# Altium project NumPadAltium.PrjPcb
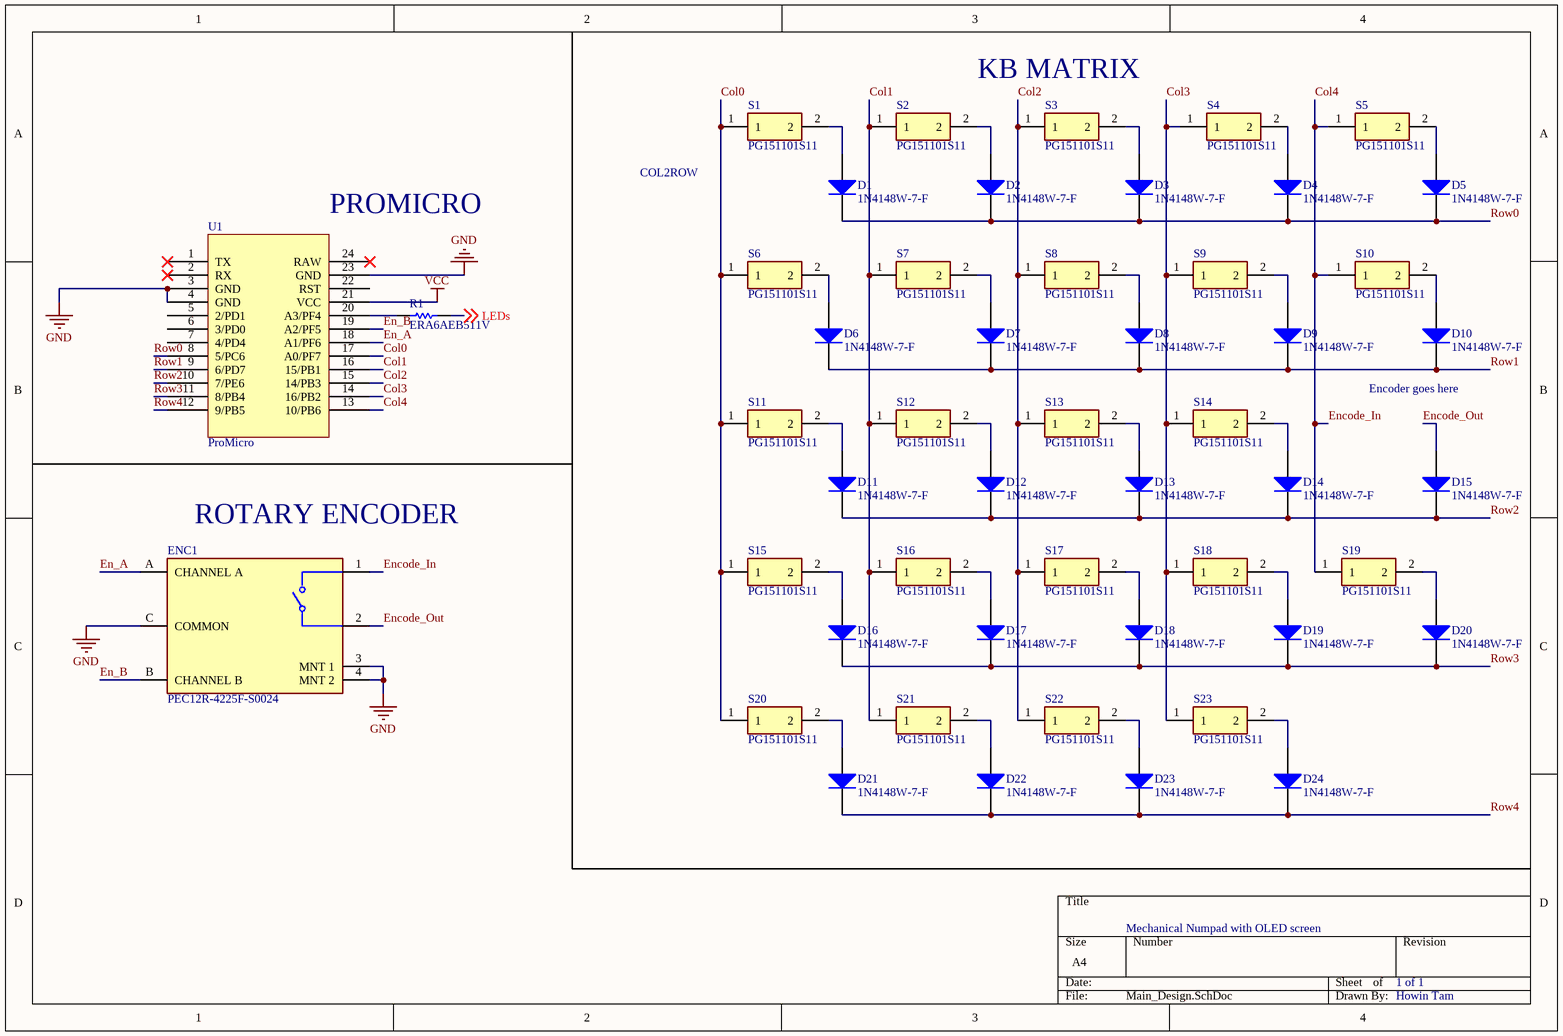
[diagram p0: Main_Design.SchDoc]
2 sheets, 96 parts. Net scope: global (net labels, ports and power ports of the same name join across sheets).
Board file: NumPadPCB.PcbDoc
Sheets:
  Main_Design.SchDoc
  InSwitchLEDs.SchDoc

## Sheet Main_Design.SchDoc
size A4; SheetNumber: 1; SheetTotal: 2

### Parts
D1  1N4148W-7-F  [DIOD-SOD123-2_V]
D2  1N4148W-7-F  [DIOD-SOD123-2_V]
D3  1N4148W-7-F  [DIOD-SOD123-2_V]
D4  1N4148W-7-F  [DIOD-SOD123-2_V]
D5  1N4148W-7-F  [DIOD-SOD123-2_V]
D6  1N4148W-7-F  [DIOD-SOD123-2_V]
D7  1N4148W-7-F  [DIOD-SOD123-2_V]
D8  1N4148W-7-F  [DIOD-SOD123-2_V]
D9  1N4148W-7-F  [DIOD-SOD123-2_V]
D10  1N4148W-7-F  [DIOD-SOD123-2_V]
D11  1N4148W-7-F  [DIOD-SOD123-2_V]
D12  1N4148W-7-F  [DIOD-SOD123-2_V]
D13  1N4148W-7-F  [DIOD-SOD123-2_V]
D14  1N4148W-7-F  [DIOD-SOD123-2_V]
D15  1N4148W-7-F  [DIOD-SOD123-2_V]
D16  1N4148W-7-F  [DIOD-SOD123-2_V]
D17  1N4148W-7-F  [DIOD-SOD123-2_V]
D18  1N4148W-7-F  [DIOD-SOD123-2_V]
D19  1N4148W-7-F  [DIOD-SOD123-2_V]
D20  1N4148W-7-F  [DIOD-SOD123-2_V]
D21  1N4148W-7-F  [DIOD-SOD123-2_V]
D22  1N4148W-7-F  [DIOD-SOD123-2_V]
D23  1N4148W-7-F  [DIOD-SOD123-2_V]
D24  1N4148W-7-F  [DIOD-SOD123-2_V]
ENC1  PEC12R-4225F-S0024  [FP-PEC12R-4225F-S0024-MFG]
R1  ERA6AEB511V  [RESC2013X60X40ML20T25]
S1  PG151101S11  [SW_PG151101S11]
S2  PG151101S11  [SW_PG151101S11]
S3  PG151101S11  [SW_PG151101S11]
S4  PG151101S11  [SW_PG151101S11]
S5  PG151101S11  [SW_PG151101S11]
S6  PG151101S11  [SW_PG151101S11]
S7  PG151101S11  [SW_PG151101S11]
S8  PG151101S11  [SW_PG151101S11]
S9  PG151101S11  [SW_PG151101S11]
S10  PG151101S11  [SW_PG151101S11]
S11  PG151101S11  [SW_PG151101S11]
S12  PG151101S11  [SW_PG151101S11]
S13  PG151101S11  [SW_PG151101S11]
S14  PG151101S11  [SW_PG151101S11]
S15  PG151101S11  [SW_PG151101S11]
S16  PG151101S11  [SW_PG151101S11]
S17  PG151101S11  [SW_PG151101S11]
S18  PG151101S11  [SW_PG151101S11]
S19  PG151101S11  [SW_PG151101S11]
S20  PG151101S11  [SW_PG151101S11]
S21  PG151101S11  [SW_PG151101S11]
S22  PG151101S11  [SW_PG151101S11]
S23  PG151101S11  [SW_PG151101S11]
U1  ProMicro  [PCBComponent_1]

### Nets
GND: ENC1.3(MNT_1) ENC1.4(MNT_2) ENC1.C(COMMON) U1.3(GND) U1.4(GND) U1.23(GND)
VCC: U1.21(VCC)
Col0: S1.1 S6.1 S11.1 S15.1 S20.1 U1.17(A0/PF7)
Col1: S2.1 S7.1 S12.1 S16.1 S21.1 U1.16(15/PB1)
Col2: S3.1 S8.1 S13.1 S17.1 S22.1 U1.15(14/PB3)
Col3: S4.1 S9.1 S14.1 S18.1 S23.1 U1.14(16/PB2)
Col4: ENC1.1 S5.1 S10.1 S19.1 U1.13(10/PB6)  [also labelled Encode_In]
En_A: ENC1.A(CHANNEL_A) U1.18(A1/PF6)
En_B: ENC1.B(CHANNEL_B) U1.19(A2/PF5)
Encode_Out: D15.1(A) ENC1.2
LEDs: R1.2 ; off-sheet LEDs
Row0: D1.2(K) D2.2(K) D3.2(K) D4.2(K) D5.2(K) U1.8(5/PC6)
Row1: D6.2(K) D7.2(K) D8.2(K) D9.2(K) D10.2(K) U1.9(6/PD7)
Row2: D11.2(K) D12.2(K) D13.2(K) D14.2(K) D15.2(K) U1.10(7/PE6)
Row3: D16.2(K) D17.2(K) D18.2(K) D19.2(K) D20.2(K) U1.11(8/PB4)
Row4: D21.2(K) D22.2(K) D23.2(K) D24.2(K) U1.12(9/PB5)
NetD1_1: D1.1(A) S1.2
NetD2_1: D2.1(A) S2.2
NetD3_1: D3.1(A) S3.2
NetD4_1: D4.1(A) S4.2
NetD5_1: D5.1(A) S5.2
NetD6_1: D6.1(A) S6.2
NetD7_1: D7.1(A) S7.2
NetD8_1: D8.1(A) S8.2
NetD9_1: D9.1(A) S9.2
NetD10_1: D10.1(A) S10.2
NetD11_1: D11.1(A) S11.2
NetD12_1: D12.1(A) S12.2
NetD13_1: D13.1(A) S13.2
NetD14_1: D14.1(A) S14.2
NetD16_1: D16.1(A) S15.2
NetD17_1: D17.1(A) S16.2
NetD18_1: D18.1(A) S17.2
NetD19_1: D19.1(A) S18.2
NetD20_1: D20.1(A) S19.2
NetD21_1: D21.1(A) S20.2
NetD22_1: D22.1(A) S21.2
NetD23_1: D23.1(A) S22.2
NetD24_1: D24.1(A) S23.2
NetR1_1: R1.1 U1.20(A3/PF4)

Not connected (* = marked no-connect by the designer): U1 1(TX)* 2(RX)* 5(2/PD1) 6(3/PD0) 7(4/PD4) 22(RST) 24(RAW)*

### Notes on the sheet
- KB MATRIX
- COL2ROW
- (near U1) PROMICRO
- (near D10) Encoder goes here
- (near ENC1) ROTARY ENCODER
- Mechanical Numpad with OLED screen
- 1 of 1
- Howin Tam

### Library data of the parts
D1-D24 = CMP-2000-04932-2: Fast Switching Diode, 100 V, 0.15 A, -65 to 150 degC, 2-Pin?SOD123, RoHS, Tape and Reel; Recovery Time: 4ns; Brand: DiodesIncorporated; Unit Weight: 0.000353oz; Max Surge Current: 2A; Peak Reverse Voltage: 100V; Ir - Reverse Current: 1uA; Vf - Forward Voltage: 1.25V; Configuration: Single; If - Forward Current: 0.15A; Product Category: Diodes-GeneralPurpose,Power,Switching; Operating Temperature Range: -65Cto+150C; Packaging: Reel; Manufacturer URL: http://www.diodes.com/; Maximum Operating Temperature: +150C; Height: 1.25mm; Minimum Operating Temperature: -65C; Product: SwitchingDiodes; Package URL: http://www.diodes.com/datasheets/ds18004.pdf; Type: SwitchingDiode; Package Reference: SOD123-2; Width: 1.7mm; Datasheet URL: http://www.farnell.com/datasheets/1915529.pdf; Datasheet Version: Rev. 24-2, 10/2013; Series: 1N4148; Factory Pack Quantity: 3000; Length: 2.85mm; RoHS: True; Manufacturer: DiodesIncorporated; Mounting Style: SMD/SMT; Package / Case: SOD-123
ENC1 = CMP-07421-000041-1: ROTARY ENCODER MECHANICAL 24PPR; Built in Switch: Yes; Hole Diameter: 1mm; Number of Channels: 2; Pulses per Revolution: 24; Output Type: Quadrature; Height: 13.4mm; Mount: Through Hole; RoHS Compliant: Yes; Orientation: Vertical; Length: 13.4mm; Encoder Type: Mechanical; Termination: PC Pin; Series: PEC12R; Min Operating Temperature: -30°C; Detent: Yes; REACH SVHC: No SVHC; Package Quantity: 75; Max Operating Temperature: 70°C; Packaging: Bulk; Width: 12.5mm
R1 = CMP-2001-00648-1: Manufacturer: Panasonic; Part Number: ERA6AEB511V
S1-S23 = PG151101S11: Keyswitch; MF: Kailh; SnapEDA_Link: https://www.snapeda.com/parts/PG151101S11/Kailh/view-part/4218555/?ref=snap; Price: None; MP: PG151101S11; Availability: Unavailable; Value: *; Package: Package
U1 = Component_1

## Sheet InSwitchLEDs.SchDoc
size A4; SheetNumber: 2; SheetTotal: 2
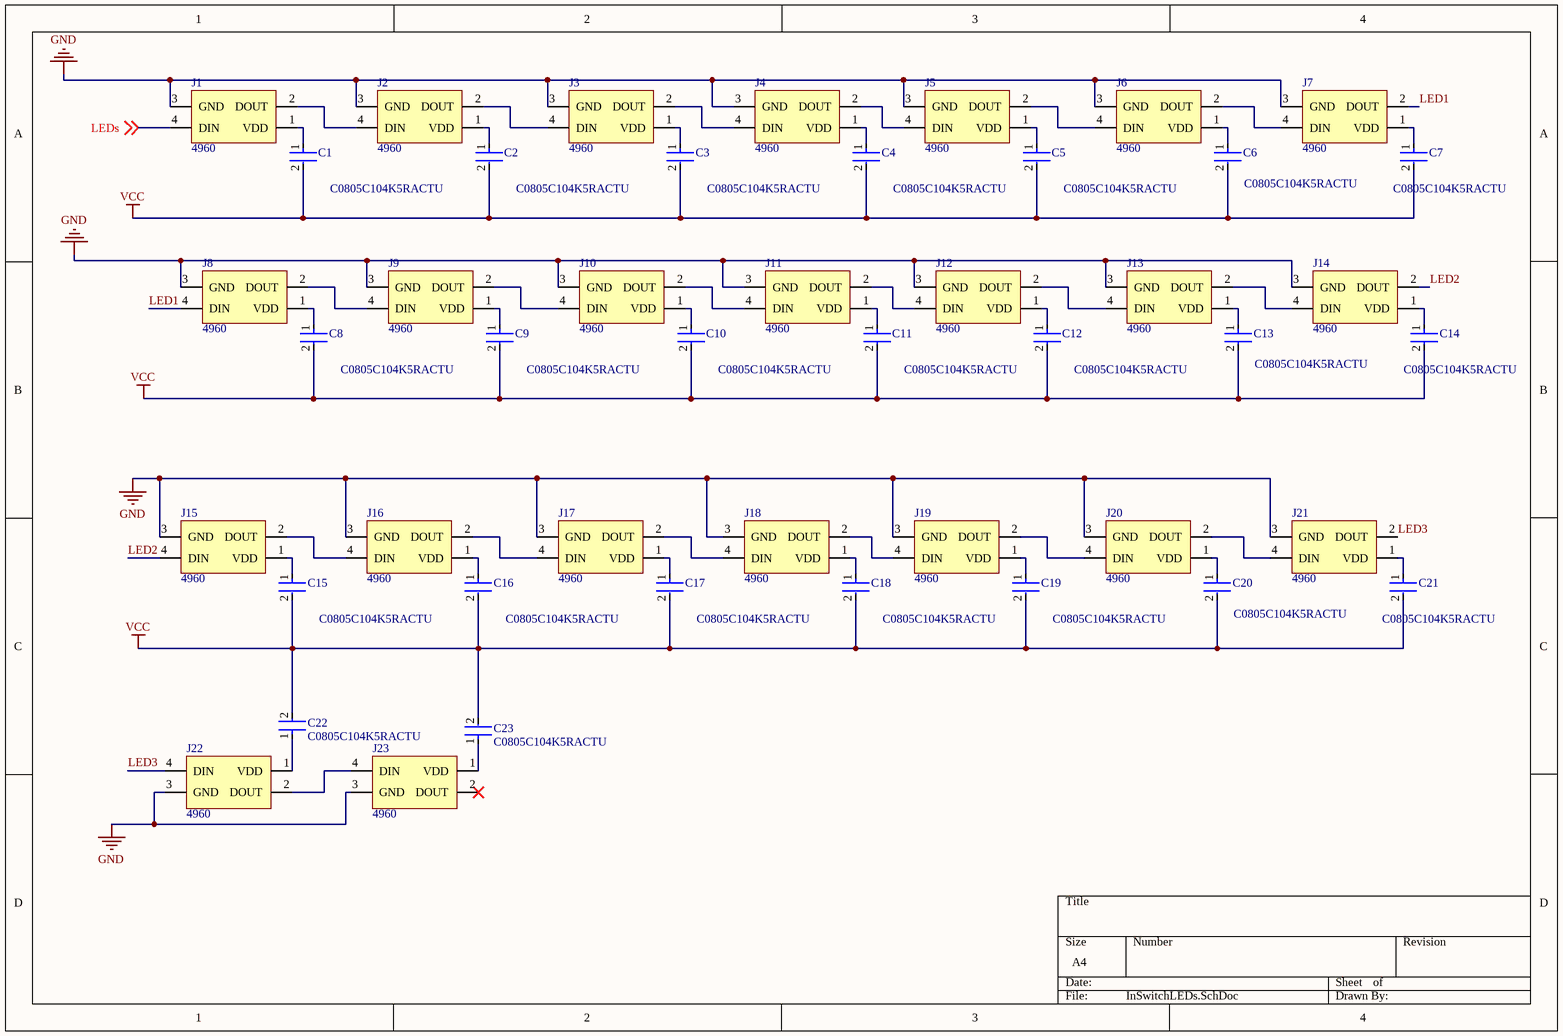
[diagram p1: InSwitchLEDs.SchDoc]

### Parts
C1  C0805C104K5RACTU  [FP-C0805C-DN-MFG]
C2  C0805C104K5RACTU  [FP-C0805C-DN-MFG]
C3  C0805C104K5RACTU  [FP-C0805C-DN-MFG]
C4  C0805C104K5RACTU  [FP-C0805C-DN-MFG]
C5  C0805C104K5RACTU  [FP-C0805C-DN-MFG]
C6  C0805C104K5RACTU  [FP-C0805C-DN-MFG]
C7  C0805C104K5RACTU  [FP-C0805C-DN-MFG]
C8  C0805C104K5RACTU  [FP-C0805C-DN-MFG]
C9  C0805C104K5RACTU  [FP-C0805C-DN-MFG]
C10  C0805C104K5RACTU  [FP-C0805C-DN-MFG]
C11  C0805C104K5RACTU  [FP-C0805C-DN-MFG]
C12  C0805C104K5RACTU  [FP-C0805C-DN-MFG]
C13  C0805C104K5RACTU  [FP-C0805C-DN-MFG]
C14  C0805C104K5RACTU  [FP-C0805C-DN-MFG]
C15  C0805C104K5RACTU  [FP-C0805C-DN-MFG]
C16  C0805C104K5RACTU  [FP-C0805C-DN-MFG]
C17  C0805C104K5RACTU  [FP-C0805C-DN-MFG]
C18  C0805C104K5RACTU  [FP-C0805C-DN-MFG]
C19  C0805C104K5RACTU  [FP-C0805C-DN-MFG]
C20  C0805C104K5RACTU  [FP-C0805C-DN-MFG]
C21  C0805C104K5RACTU  [FP-C0805C-DN-MFG]
C22  C0805C104K5RACTU  [FP-C0805C-DN-MFG]
C23  C0805C104K5RACTU  [FP-C0805C-DN-MFG]
J1  4960  [4960_Adafruit]
J2  4960  [4960_Adafruit]
J3  4960  [4960_Adafruit]
J4  4960  [4960_Adafruit]
J5  4960  [4960_Adafruit]
J6  4960  [4960_Adafruit]
J7  4960  [4960_Adafruit]
J8  4960  [4960_Adafruit]
J9  4960  [4960_Adafruit]
J10  4960  [4960_Adafruit]
J11  4960  [4960_Adafruit]
J12  4960  [4960_Adafruit]
J13  4960  [4960_Adafruit]
J14  4960  [4960_Adafruit]
J15  4960  [4960_Adafruit]
J16  4960  [4960_Adafruit]
J17  4960  [4960_Adafruit]
J18  4960  [4960_Adafruit]
J19  4960  [4960_Adafruit]
J20  4960  [4960_Adafruit]
J21  4960  [4960_Adafruit]
J22  4960  [4960_Adafruit]
J23  4960  [4960_Adafruit]

### Nets
GND: J1.3(GND) J2.3(GND) J3.3(GND) J4.3(GND) J5.3(GND) J6.3(GND) J7.3(GND) J8.3(GND) J9.3(GND) J10.3(GND) J11.3(GND) J12.3(GND) J13.3(GND) J14.3(GND) J15.3(GND) J16.3(GND) J17.3(GND) J18.3(GND) J19.3(GND) J20.3(GND) J21.3(GND) J22.3(GND) J23.3(GND)
VCC: C1.2 C2.2 C3.2 C4.2 C5.2 C6.2 C7.2 C8.2 C9.2 C10.2 C11.2 C12.2 C13.2 C14.2 C15.2 C16.2 C17.2 C18.2 C19.2 C20.2 C21.2 C22.2 C23.2
LED1: J7.2(DOUT) J8.4(DIN)
LED2: J14.2(DOUT) J15.4(DIN)
LED3: J21.2(DOUT) J22.4(DIN)
LEDs: J1.4(DIN) ; off-sheet LEDs
NetC1_1: C1.1 J1.1(VDD)
NetC2_1: C2.1 J2.1(VDD)
NetC3_1: C3.1 J3.1(VDD)
NetC4_1: C4.1 J4.1(VDD)
NetC5_1: C5.1 J5.1(VDD)
NetC6_1: C6.1 J6.1(VDD)
NetC7_1: C7.1 J7.1(VDD)
NetC8_1: C8.1 J8.1(VDD)
NetC9_1: C9.1 J9.1(VDD)
NetC10_1: C10.1 J10.1(VDD)
NetC11_1: C11.1 J11.1(VDD)
NetC12_1: C12.1 J12.1(VDD)
NetC13_1: C13.1 J13.1(VDD)
NetC14_1: C14.1 J14.1(VDD)
NetC15_1: C15.1 J15.1(VDD)
NetC16_1: C16.1 J16.1(VDD)
NetC17_1: C17.1 J17.1(VDD)
NetC18_1: C18.1 J18.1(VDD)
NetC19_1: C19.1 J19.1(VDD)
NetC20_1: C20.1 J20.1(VDD)
NetC21_1: C21.1 J21.1(VDD)
NetC22_1: C22.1 J22.1(VDD)
NetC23_1: C23.1 J23.1(VDD)
NetJ1_2: J1.2(DOUT) J2.4(DIN)
NetJ2_2: J2.2(DOUT) J3.4(DIN)
NetJ3_2: J3.2(DOUT) J4.4(DIN)
NetJ4_2: J4.2(DOUT) J5.4(DIN)
NetJ5_2: J5.2(DOUT) J6.4(DIN)
NetJ6_2: J6.2(DOUT) J7.4(DIN)
NetJ8_2: J8.2(DOUT) J9.4(DIN)
NetJ9_2: J9.2(DOUT) J10.4(DIN)
NetJ10_2: J10.2(DOUT) J11.4(DIN)
NetJ11_2: J11.2(DOUT) J12.4(DIN)
NetJ12_2: J12.2(DOUT) J13.4(DIN)
NetJ13_2: J13.2(DOUT) J14.4(DIN)
NetJ15_2: J15.2(DOUT) J16.4(DIN)
NetJ16_2: J16.2(DOUT) J17.4(DIN)
NetJ17_2: J17.2(DOUT) J18.4(DIN)
NetJ18_2: J18.2(DOUT) J19.4(DIN)
NetJ19_2: J19.2(DOUT) J20.4(DIN)
NetJ20_2: J20.2(DOUT) J21.4(DIN)
NetJ22_2: J22.2(DOUT) J23.4(DIN)

Not connected (* = marked no-connect by the designer): J23 2(DOUT)*

### Library data of the parts
C1-C23 = CMP-2007-00279-2: CAP CER 0.1UF 50V X7R 0805; Manufacturer: KEMET; Value: 0.10 μF; Tolerance: 0.1; Temperature Coefficient: 30ppm/°C; Material: Ceramic; Manufacturer Part Number: C0805C104K5RACTU; Device Class L2: Capacitors; Temperature Range Low: -55°C; Voltage Rating: 50 V; Digikey Description: CAP CER 0.1UF 50V X7R 0805; Category: Cap; ComponentLink2Description: Datasheet; Octopart: https://octopart.com/c0805c104k5ractu-kemet-143926; RoHS: TRUE; ComponentLink2URL: https://content.kemet.com/datasheets/KEM_C1003_C0G_SMD.pdf; Temperature Characteristic: X7R; Temperature: -55°C to +125°C; Height: 0.88mm; Temperature Range High: +125°C; Device Class L1: Passive Components; Automotive: No; Lead Free: Yes; Ipc Land Pattern Name: CAPC200125X78; Device Class L3: Ceramic Capacitors; Mouser Description: Cap Ceramic 0.1uF 50V X7R 10% SMD 2.0 x 1.2 mm 125 C Paper T/R; Capacitance: 0.10 μF; Package: C0805C-DN
J1-J23 = Component_1

## Nets that join several sheets
GND: Main_Design (6 pins), InSwitchLEDs (23 pins)
VCC: Main_Design (U1.21), InSwitchLEDs (23 pins)
LEDs: Main_Design (R1.2), InSwitchLEDs (J1.4)